# EAGLE schematic bidirectional-motor-driver (EAGLE 7.2.0)
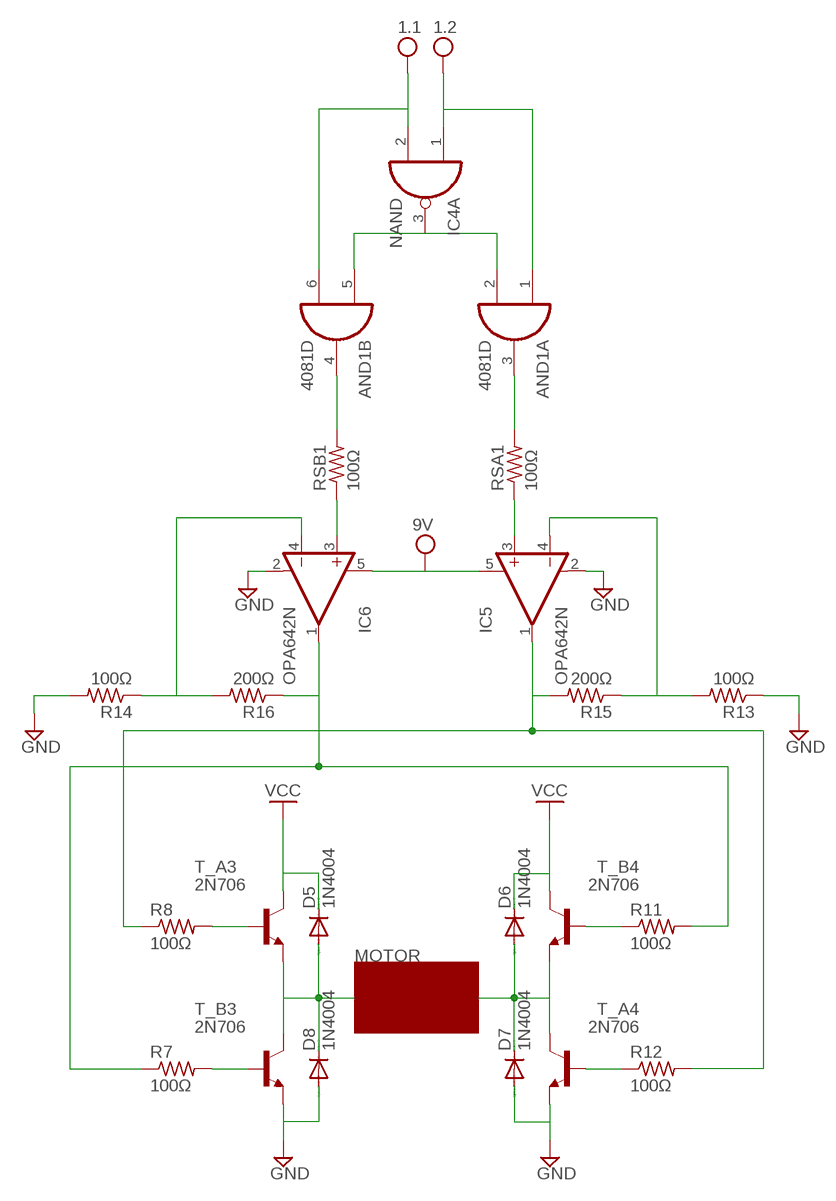
[diagram p0: schematic, sheet 1]

## Parts
AND1  4081D  [SO14]
D5  1N4004  [DO41-10]
D6  1N4004  [DO41-10]
D7  1N4004  [DO41-10]
D8  1N4004  [DO41-10]
IC4  NAND  4011D  [SO14]
IC5  OPA642N  [SOT23-5]
IC6  OPA642N  [SOT23-5]
R7  100Ω  R-US_0204/2V  [0204V]
R8  100Ω  R-US_0204/2V  [0204V]
R11  100Ω  R-US_0204/2V  [0204V]
R12  100Ω  R-US_0204/2V  [0204V]
R13  100Ω  R-US_0204/2V  [0204V]
R14  100Ω  R-US_0204/2V  [0204V]
R15  200Ω  R-US_0204/2V  [0204V]
R16  200Ω  R-US_0204/2V  [0204V]
RSA1  100Ω  R-US_0204/2V  [0204V]
RSB1  100Ω  R-US_0204/2V  [0204V]
T_A3  2N706  [TO18]
T_A4  2N706  [TO18]
T_B3  2N706  [TO18]
T_B4  2N706  [TO18]

## Nets
GND: D7.A D8.A IC5.2(V-) IC6.2(V-) R13.1 R14.2 T_A4.1(E) T_B3.1(E)
N$20: D6.A D7.C T_A4.3(C) T_B4.1(E)
N$21: D5.A D8.C T_A3.1(E) T_B3.3(C)
N$22: R12.1 T_A4.2(B)
N$23: R11.1 T_B4.2(B)
N$24: R8.2 T_A3.2(B)
N$25: R7.2 T_B3.2(B)
N$26: AND1.2(A:I1) AND1.5(B:I0) IC4.3(A:O)
N$27: IC6.1(OUT) R7.1 R11.2
N$28: IC5.1(OUT) R8.1 R12.2
N$29: AND1.4(B:O) RSB1.2
N$30: AND1.3(A:O) RSA1.2
N$31: IC5.3(+IN) RSA1.1
N$32: IC6.3(+IN) RSB1.1
N$33: IC6.4(-IN)
N$34: IC5.4(-IN)
N$35: IC5.5(V+) IC6.5(V+)
N$36: R14.1 R16.2
N$37: R13.2 R15.1
N$38: R15.2
N$39: R16.1
VCC: D5.C D6.C T_A3.3(C) T_B4.3(C)
VDD: AND1.1(A:I0) AND1.6(B:I1) IC4.1(A:I0) IC4.2(A:I1) ; supply symbol labelled 1.1, 1.2
Unconnected: AND1.8(C:I0) AND1.9(C:I1) AND1.10(C:O) AND1.11(D:O) AND1.12(D:I0) AND1.13(D:I1) IC4.4(B:O) IC4.5(B:I0) IC4.6(B:I1) IC4.8(C:I0) IC4.9(C:I1) IC4.10(C:O) IC4.11(D:O) IC4.12(D:I0) IC4.13(D:I1)

## Notes on the sheet
- MOTOR

## Power pins joined to a net without a drawn wire
VDD: AND1.14(P:VDD) IC4.14(P:VDD)
VSS: AND1.7(P:VSS) IC4.7(P:VSS)

## Library data of the parts
AND1 = 40xx:4081: Quad 2-input AND
D5-D8 = diode:1N4004: DIODE general purpose rectifier, 1 A
IC4 = 40xx:4011: Quad 2-input NAND
IC5 IC6 = burr-brown:OPA642N: Operational Amplifier Wideband, Low Distortion; OC_FARNELL: unknown; OC_NEWARK: unknown
R7 R8 R11-R16 RSA1 RSB1 = rcl:R-US_: RESISTOR, American symbol
T_A3 T_A4 T_B3 T_B4 = transistor:2N706: NPN TRANSISTOR